# Altium schematic sheet 1_自定义接口.schdoc.schdoc
size 309 x 223 mm; Symbol: Sheet-Symbol_A4; Device: Sheet-Symbol_A4; @Page Name: 自定义接口; @Create Date: 2023-12-01; @Page Count: 10; @Page No: 10; @Project Name: STM32F722RET6; @Schematic Name: 开发板; @Update Date: 2023-12-01; Company: 嘉立创EDA; Page Size: A4; Version: V1.0
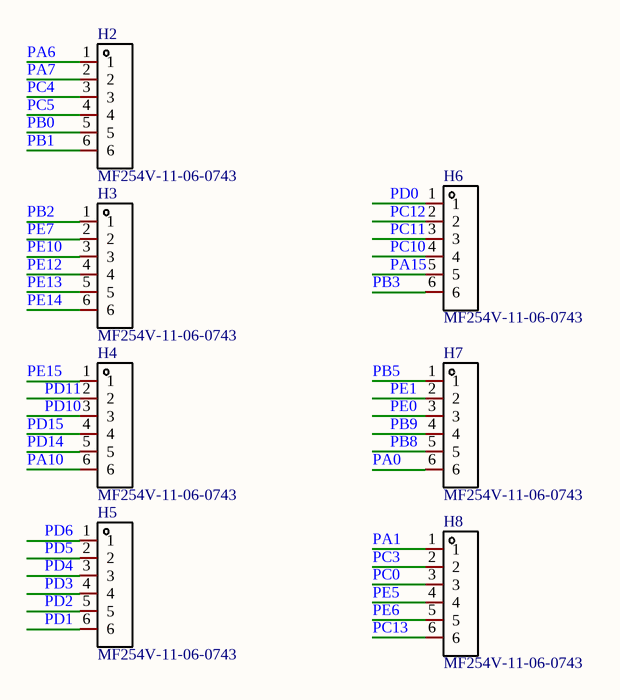
[diagram p0: 1_自定义接口.schdoc.schdoc]

## Parts
H2  MF254V-11-06-0743  [HDR-TH_6P-P2.54-V-F_MF254V-11-06-0743]
H3  MF254V-11-06-0743  [HDR-TH_6P-P2.54-V-F_MF254V-11-06-0743]
H4  MF254V-11-06-0743  [HDR-TH_6P-P2.54-V-F_MF254V-11-06-0743]
H5  MF254V-11-06-0743  [HDR-TH_6P-P2.54-V-F_MF254V-11-06-0743]
H6  MF254V-11-06-0743  [HDR-TH_6P-P2.54-V-F_MF254V-11-06-0743]
H7  MF254V-11-06-0743  [HDR-TH_6P-P2.54-V-F_MF254V-11-06-0743]
H8  MF254V-11-06-0743  [HDR-TH_6P-P2.54-V-F_MF254V-11-06-0743]

## Nets
PA0: H7.6
PA1: H8.1
PA6: H2.1
PA7: H2.2
PA10: H4.6
PA15: H6.5
PB0: H2.5
PB1: H2.6
PB2: H3.1
PB3: H6.6
PB5: H7.1
PB8: H7.5
PB9: H7.4
PC0: H8.3
PC3: H8.2
PC4: H2.3
PC5: H2.4
PC10: H6.4
PC11: H6.3
PC12: H6.2
PC13: H8.6
PD0: H6.1
PD1: H5.6
PD2: H5.5
PD3: H5.4
PD4: H5.3
PD5: H5.2
PD6: H5.1
PD10: H4.3
PD11: H4.2
PD14: H4.5
PD15: H4.4
PE0: H7.3
PE1: H7.2
PE5: H8.4
PE6: H8.5
PE7: H3.2
PE10: H3.3
PE12: H3.4
PE13: H3.5
PE14: H3.6
PE15: H4.1

## Notes on the sheet
- 1
- 2
- 3
- 4
- 5
- 6
- A
- B
- C
- 原理图
- 开发板
- 创建日期
- 更新日期
- 2023-12-01
- 审阅
- 绘制
- 图页
- 自定义接口
- 物料编码
- STM32F722RET6
- D
- 版本
- 尺寸
- 页
- 10
- 共
- V1.0
- A4
- 嘉立创EDA

## Library data of the parts
H2-H8 = MF254V-11-06-0743: 排数:单排;总孔位数:6P;间距:2.54mm;插孔结构:1x6P;行距:-;安装类型:直插;圆孔/方孔:圆孔;额定电流:3A;额定电压:60V;插孔方向:顶部;塑高:3mm;工作温度范围:-40℃~+105℃;; Manufacturer: XFCN(兴飞); Add into BOM: yes; Number of Holes: 6P; Pitch: 2.54mm; Holes Structure: 1x6P; Circular Hole / Square Hole: 圆孔; Current Rating (Max): 3A; Voltage Rating (Max): 60V; Holes Direction: 顶部; Name: MF254V-11-06-0743; Symbol: MF254V-11-06-0743; Device: MF254V-11-06-0743; LCSC Part Name: 间距:2.54mm 1x6P 直插; Supplier Part: C962325; Manufacturer Part: MF254V-11-06-0743; Supplier Footprint: 插件,P=2.54mm; JLCPCB Part Class: 扩展库; Datasheet: https://atta.szlcsc.com/upload/public/pdf/source/20200408/C510959_8640BFA72E43E78C14C3EAA65BA5C05B.pdf; Supplier: LCSC; Convert to PCB: yes; Number of Rows: 单排; Row Spacing: -; Mounting Type: 直插; Insulation Height: 3mm; Operating Temperature Range: -40℃~+105℃